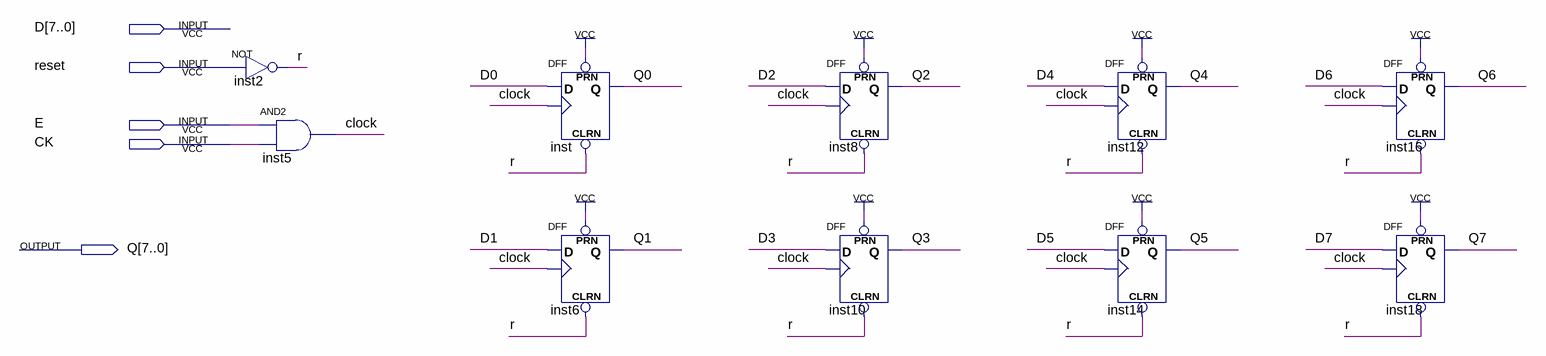
[diagram p0: schematic sheet]
// Quartus schematic Registrador8bits.bdf as structural Verilog: 10 symbols, 5 pins
module Registrador8bits (
  input  [7:0] D,
  input  reset,
  input  E,
  input  CK,
  output [7:0] Q
);

  wire clock, r;

  not inst2 (r, reset);
  and inst5 (clock, E, CK);
  DFF inst (.CLRN(r), .CLK(clock), .D(D[0]), .PRN(1'b1), .Q(Q[0]));
  DFF inst6 (.CLRN(r), .CLK(clock), .D(D[1]), .PRN(1'b1), .Q(Q[1]));
  DFF inst8 (.CLRN(r), .CLK(clock), .D(D[2]), .PRN(1'b1), .Q(Q[2]));
  DFF inst10 (.CLRN(r), .CLK(clock), .D(D[3]), .PRN(1'b1), .Q(Q[3]));
  DFF inst12 (.CLRN(r), .CLK(clock), .D(D[4]), .PRN(1'b1), .Q(Q[4]));
  DFF inst14 (.CLRN(r), .CLK(clock), .D(D[5]), .PRN(1'b1), .Q(Q[5]));
  DFF inst16 (.CLRN(r), .CLK(clock), .D(D[6]), .PRN(1'b1), .Q(Q[6]));
  DFF inst18 (.CLRN(r), .CLK(clock), .D(D[7]), .PRN(1'b1), .Q(Q[7]));
endmodule
